# Altium schematic sheet ADHV.SchDoc: =Project
size 420 x 297 mm; Author: G.Kasprowicz; CompanyName: WUT ISE; DrawnBy: G.Kasprowicz; Organization: WUT ISE; Address1: PW ISE; Address2: Nowowiejska 15/19 00-665 Warsaw; Address3: gkasprow@gmail.com; SheetNumber: -; SheetTotal: -; ModifiedBy: -; CheckedDate: -; Title2: Top; DivGrp: WUT ISE; Designer: G.Kasprowicz; SPICEModelCacheRYPVXPCY: <root> / <DocumentId>RYPVXPCY</DocumentId> / </root>; ModifiedDate: -; ProjectName: Sensor Box
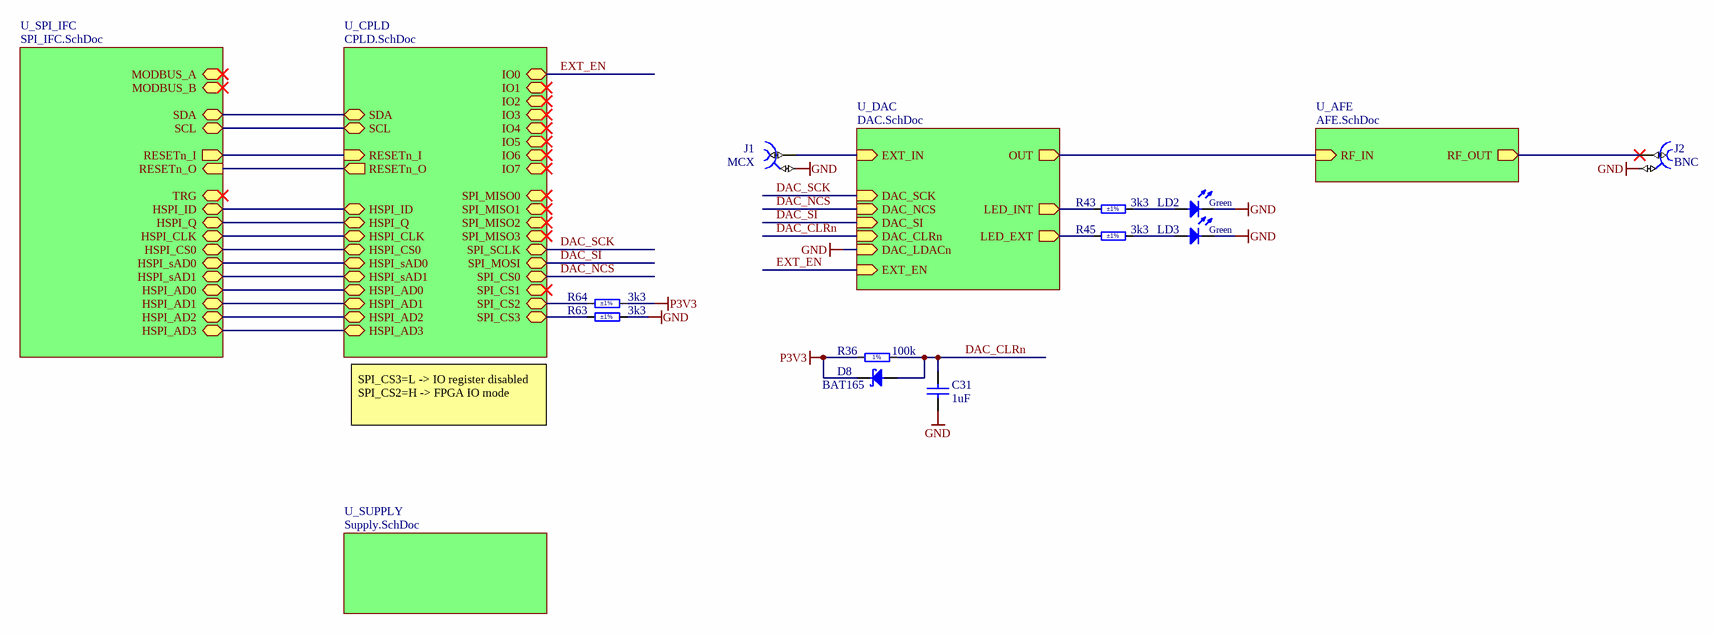
[diagram p0: ADHV.SchDoc]

## Parts
C31  1uF  [CAPC1005X55N]
D8  BAT165  [SOD2512X110N]
J1  MCX  [AMPHENOL_919-109J-51PX]
J2  BNC  [TYCO_5-1634506-1]
LD2  Green  [LED_KINGBRIGHT_KP-1608CGCK]
LD3  Green  [LED_KINGBRIGHT_KP-1608CGCK]
R36  100k  [RESC1005X40N]
R43  3k3  Tolerance: ±1%  [RESC1005X40N]
R45  3k3  Tolerance: ±1%  [RESC1005X40N]
R63  3k3  Tolerance: ±1%  [RESC1005X40N]
R64  3k3  Tolerance: ±1%  [RESC1005X40N]

## Sub-sheets
U_AFE = AFE.SchDoc: RF_IN (in), RF_OUT (out)
U_CPLD = CPLD.SchDoc: SDA (bidir), SCL (bidir), RESETn_I (in), RESETn_O (out), HSPI_ID (bidir), HSPI_Q (bidir), HSPI_CLK (bidir), HSPI_CS0 (bidir), HSPI_sAD0 (bidir), HSPI_sAD1 (bidir), HSPI_AD0 (bidir), HSPI_AD1 (bidir), HSPI_AD2 (bidir), HSPI_AD3 (bidir), IO5 (bidir), IO0 (bidir), IO1 (bidir), SPI_MISO2 (bidir), SPI_CS3 (bidir), SPI_CS1 (bidir), SPI_SCLK (bidir), IO4 (bidir), SPI_MISO3 (bidir), IO3 (bidir), SPI_MISO0 (bidir), SPI_CS0 (bidir), SPI_MOSI (bidir), SPI_CS2 (bidir), IO2 (bidir), IO7 (bidir), SPI_MISO1 (bidir), IO6 (bidir)
U_DAC = DAC.SchDoc: OUT (out), EXT_IN (in), LED_INT (out), LED_EXT (out), DAC_SCK (in), DAC_NCS (in), DAC_LDACn (in), DAC_CLRn (in), DAC_SI (in), EXT_EN (in)
U_SPI_IFC = SPI_IFC.SchDoc: TRG (bidir), SCL (bidir), RESETn_O (in), MODBUS_A (bidir), HSPI_AD3 (bidir), MODBUS_B (bidir), RESETn_I (out), SDA (bidir), HSPI_CLK (bidir), HSPI_Q (bidir), HSPI_sAD0 (bidir), HSPI_ID (bidir), HSPI_AD2 (bidir), HSPI_CS0 (bidir), HSPI_AD1 (bidir), HSPI_sAD1 (bidir), HSPI_AD0 (bidir)
U_SUPPLY = Supply.SchDoc: no entries

## Nets
GND: C31.1 J1.2 J2.2 LD2.1(C) LD3.1(C) R63.2 ; sheet U_DAC/DAC_LDACn
P3V3: D8.1(C) R36.2 R64.2
DAC_CLRn: C31.2 D8.2(A) R36.1 ; sheet U_DAC/DAC_CLRn
DAC_NCS: sheet U_CPLD/SPI_CS0, sheet U_DAC/DAC_NCS
DAC_SCK: sheet U_CPLD/SPI_SCLK, sheet U_DAC/DAC_SCK
DAC_SI: sheet U_CPLD/SPI_MOSI, sheet U_DAC/DAC_SI
EXT_EN: sheet U_CPLD/IO0, sheet U_DAC/EXT_EN
NetJ1_1: J1.1 ; sheet U_DAC/EXT_IN
NetJ2_1: J2.1 ; sheet U_AFE/RF_OUT
NetLD2_2: LD2.2(A) R43.1
NetLD3_2: LD3.2(A) R45.1
NetR43_2: R43.2 ; sheet U_DAC/LED_INT
NetR45_2: R45.2 ; sheet U_DAC/LED_EXT
NetR63_1: R63.1 ; sheet U_CPLD/SPI_CS3
NetR64_1: R64.1 ; sheet U_CPLD/SPI_CS2
(unnamed): sheet U_SPI_IFC/SCL, sheet U_CPLD/SCL
(unnamed): sheet U_SPI_IFC/RESETn_O, sheet U_CPLD/RESETn_O
(unnamed): sheet U_SPI_IFC/HSPI_AD3, sheet U_CPLD/HSPI_AD3
(unnamed): sheet U_SPI_IFC/RESETn_I, sheet U_CPLD/RESETn_I
(unnamed): sheet U_SPI_IFC/SDA, sheet U_CPLD/SDA
(unnamed): sheet U_SPI_IFC/HSPI_CLK, sheet U_CPLD/HSPI_CLK
(unnamed): sheet U_SPI_IFC/HSPI_Q, sheet U_CPLD/HSPI_Q
(unnamed): sheet U_SPI_IFC/HSPI_sAD0, sheet U_CPLD/HSPI_sAD0
(unnamed): sheet U_SPI_IFC/HSPI_ID, sheet U_CPLD/HSPI_ID
(unnamed): sheet U_SPI_IFC/HSPI_AD2, sheet U_CPLD/HSPI_AD2
(unnamed): sheet U_SPI_IFC/HSPI_CS0, sheet U_CPLD/HSPI_CS0
(unnamed): sheet U_SPI_IFC/HSPI_AD1, sheet U_CPLD/HSPI_AD1
(unnamed): sheet U_SPI_IFC/HSPI_sAD1, sheet U_CPLD/HSPI_sAD1
(unnamed): sheet U_SPI_IFC/HSPI_AD0, sheet U_CPLD/HSPI_AD0
(unnamed): sheet U_AFE/RF_IN, sheet U_DAC/OUT

## Notes on the sheet
- SPI_CS3=L -> IO register disabled
  SPI_CS2=H -> FPGA IO mode
- Project/Equipment
- Document
- Designer
- Drawn by
- Check.by
- Copyright WUT ISE 2018.
  This documentation describes Open Hardware and is licensed under the CERN OHL v.1.1. You may redistribute and modify this documentation under the terms of the CERN OHL v.1.1. (http://ohwr.org/CERNOHL). This documentation is distributed WITHOUT ANY EXPRESS OR IMPLIED WARRANTY, INCLUDING OF MERCHANTABILITY, SATISFACTORY QUALITY AND FITNESS FOR A PARTICULAR PURPOSE. Please see the CERN OHL v.1.1 for applicable conditions.
- Contact
- File
- Last Mod.
- Print Date
- Sheet
- Size
- A3
- of
- Rev
- (in symbol R0402_100K_1%_0.0625W_100PPM) 1%

## Library data of the parts
C31 = CC0402_1UF_16V_10%_X5R: Non-polarised capacitor; Part Description: SMD Multilayer Chip Ceramic Capacitor; Manufacturer: GENERIC; Manufacturer1 Part Number: C1005X5R1C105KT; Voltage: 16V; TC: X5R; Tolerance: ±10%; Part Number: CC0402_1UF_16V_10%_X5R; Component Kind: Standard; Component Type: Standard; Pin Count: 2; Value: 1uF; Status: Preferred; Manufacturer Part Number: CC0402_1UF_16V_10%_X5R; Case: 0402; Mounted: Yes; Socket: No; SMD: Yes; Sense: No; Manufacturer1 Example: TDK; Manufacturer1 ComponentHeight: 0.55mm; HelpURL: \\cern.ch\dfs\Applications\Altium\Datasheets\CC0402_X5R_TDK_C.pdf; Author: CERN DEM JLC; CreateDate: 25.10.2012; LatestRevisionDate: 25.10.2012
D8 = BAT165: Schottky Diode; Part Description: Medium Power AF Schottky Diode; Manufacturer: INFINEON; Voltage: 40V; Power: 750mA; PressFit: No; Bonding: No; Part Number: BAT165; Component Kind: Standard; Component Type: Standard; Device: BAT165; PackageDescription: Small Outline Diode (SOD-323), 1.70mm W X 1.25mm L X 1.10mm H body,  IPC Medium Density; Manufacturer Part Number: BAT165; Pin Count: 2; Case: SOD-323; Mounted: Yes; Socket: No; SMD: Yes; Sense: No; ComponentHeight: 1.1mm; HelpURL: \\cern.ch\dfs\Applications\Altium\Datasheets\BAT165.pdf; Author: CERN DEM JLC; CreateDate: 12.11.2014; LatestRevisionDate: 12.11.2014
J1 = AMPHENOL_919-109J-51PX: Part Description: 50 Ohms, RF Connector, MCX Straight PCB Receptacle Jack; Manufacturer Part Number: 919-109J-51PX (MCX6251B1-3GT30G-50); PressFit: No; Part Number: AMPHENOL_919-109J-51PX; Component Kind: Standard; Component Type: Standard; Pin Count: 5; Family: MCX; Mounted: Yes; Socket: No; SMD: No; Sense: No; Status: None; Manufacturer: AMPHENOL; ComponentHeight: 6.06mm; HelpURL: \\cern.ch\dfs\Applications\Altium\Datasheets\AMPHENOL_919-109J-51PX.pdf; Author: CERN DEM BC; CreateDate: 31.01.2019; LatestRevisionDate: 31.01.2019
J2 = TYCO_5-1634506-1: Part Description: 50 Ohms BNC PCB Straight Socket; Manufacturer: TYCO ELECTRONICS; PressFit: No; Part Number: TYCO_5-1634506-1; Component Kind: Standard; Component Type: Standard; Pin Count: 2; Family: BNC; Mounted: Yes; Socket: No; SMD: No; Sense: No; Status: None; Manufacturer Part Number: 5-1634506-1; ComponentHeight: 16.7mm; HelpURL: \\cern.ch\dfs\Applications\Altium\Datasheets\TYCO_5-1634506-1.pdf; Author: CERN DEM JLC; CreateDate: 14/02/2011; LatestRevisionDate: 14/02/2011
LD2 LD3 = LED_KINGBRIGHT_KP-1608CGCK: LED Green 1C 2A; Part Description: 1.6x0.8mm SMD Chip Green LED Lamp; PressFit: No; Bonding: No; Part Number: LED_KINGBRIGHT_KP-1608CGCK; Component Kind: Standard; Component Type: Standard; Color: Green; PackageDescription: SMT Green LED, Case 0603, Body L 1.60mm x W 0.80mm x H 1.10mm; Manufacturer: KINGBRIGHT; Manufacturer Part Number: KP-1608CGCK; Pin Count: 2; Case: 0603; Mounted: Yes; Socket: No; SMD: Yes; Sense: No; ComponentHeight: 1.1mm; HelpURL: \\cern.ch\dfs\Applications\Altium\Datasheets\LED_KINGBRIGHT_KP-1608CGCK.pdf; Author: CERN DEM HF; CreateDate: 01.10.2021; LatestRevisionDate: 01.10.2021
R36 = R0402_100K_1%_0.0625W_100PPM: Resistor - 1%; Part Description: General Purpose Thick Film Chip Resistor; Manufacturer: GENERIC; Manufacturer1 Part Number: 232270671004L; PressFit: No; TC: ±100ppm/°C; Part Number: R0402_100K_1%_0.0625W_100PPM; Component Kind: Standard; Component Type: Standard; Pin Count: 2; Value: 100k; Status: Not Recommended; Manufacturer Part Number: R0402_100K_1%_0.0625W_100PPM; Case: 0402; Mounted: Yes; Sense: No; Socket: No; SMD: Yes; Manufacturer1 Example: YAGEO PHYCOMP; Manufacturer1 ComponentHeight: 0.4mm; HelpURL: \\cern.ch\dfs\Applications\Altium\Datasheets\R0402_Phycomp_RC0402.pdf; Author: CERN DEM JLC; CreateDate: 03.12.2007; LatestRevisionDate: 17.10.2012; Power: 0.0625W; Tolerance: ±1%
R43 R45 R63 R64 = R0402_3K3_1%_0.0625W_100PPM: Resistor - 1%; Part Description: General Purpose Thick Film Chip Resistor; Manufacturer: GENERIC; Manufacturer1 Part Number: 232270673302L; TC: ±100ppm/°C; PressFit: No; Part Number: R0402_3K3_1%_0.0625W_100PPM; Component Kind: Standard; Component Type: Standard; Pin Count: 2; Value: 3k3; Status: Not Recommended; Power: 0.0625W; Manufacturer Part Number: R0402_3K3_1%_0.0625W_100PPM; Case: 0402; Mounted: Yes; Sense: No; Socket: No; SMD: Yes; Manufacturer1 Example: YAGEO PHYCOMP; Manufacturer1 ComponentHeight: 0.4mm; HelpURL: \\cern.ch\dfs\Applications\Altium\Datasheets\R0402_Phycomp_RC0402.pdf; Author: CERN DEM JLC; CreateDate: 03.12.2007; LatestRevisionDate: 17.10.2012